# Altium schematic sheet WifiNode_Blk_R00.SchDoc: WifiNode_Blk_R00
size A4; Author: Sfara, Gonzalo Agustín; CompanyName: Introducción al Diseño de Circuitos Impresos; Organization: UTN FRBA; Revision: 00; SheetNumber: 1; SheetTotal: 5
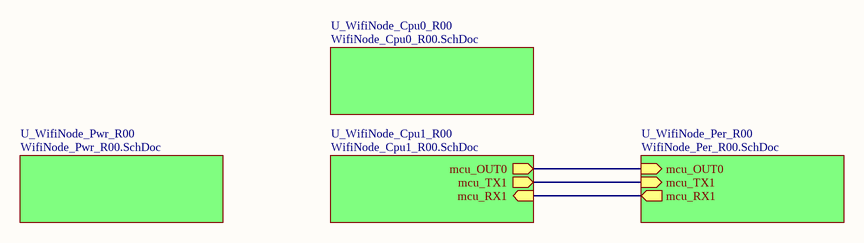
[diagram p0: WifiNode_Blk_R00.SchDoc]

## Sub-sheets
U_WifiNode_Cpu0_R00 = WifiNode_Cpu0_R00.SchDoc: no entries
U_WifiNode_Cpu1_R00 = WifiNode_Cpu1_R00.SchDoc: mcu_OUT0 (out), mcu_TX1 (out), mcu_RX1 (in)
U_WifiNode_Per_R00 = WifiNode_Per_R00.SchDoc: mcu_OUT0 (in), mcu_RX1 (out), mcu_TX1 (in)
U_WifiNode_Pwr_R00 = WifiNode_Pwr_R00.SchDoc: no entries

## Nets
(unnamed): sheet U_WifiNode_Cpu1_R00/mcu_OUT0, sheet U_WifiNode_Per_R00/mcu_OUT0
(unnamed): sheet U_WifiNode_Cpu1_R00/mcu_TX1, sheet U_WifiNode_Per_R00/mcu_TX1
(unnamed): sheet U_WifiNode_Cpu1_R00/mcu_RX1, sheet U_WifiNode_Per_R00/mcu_RX1

## Notes on the sheet
- Title:
- Size:
- Author:
- A4
- Sheet
- of
- Revision:
- File:
- Date: